# Altium project Elec391_Project_Gen_2.PrjPcb
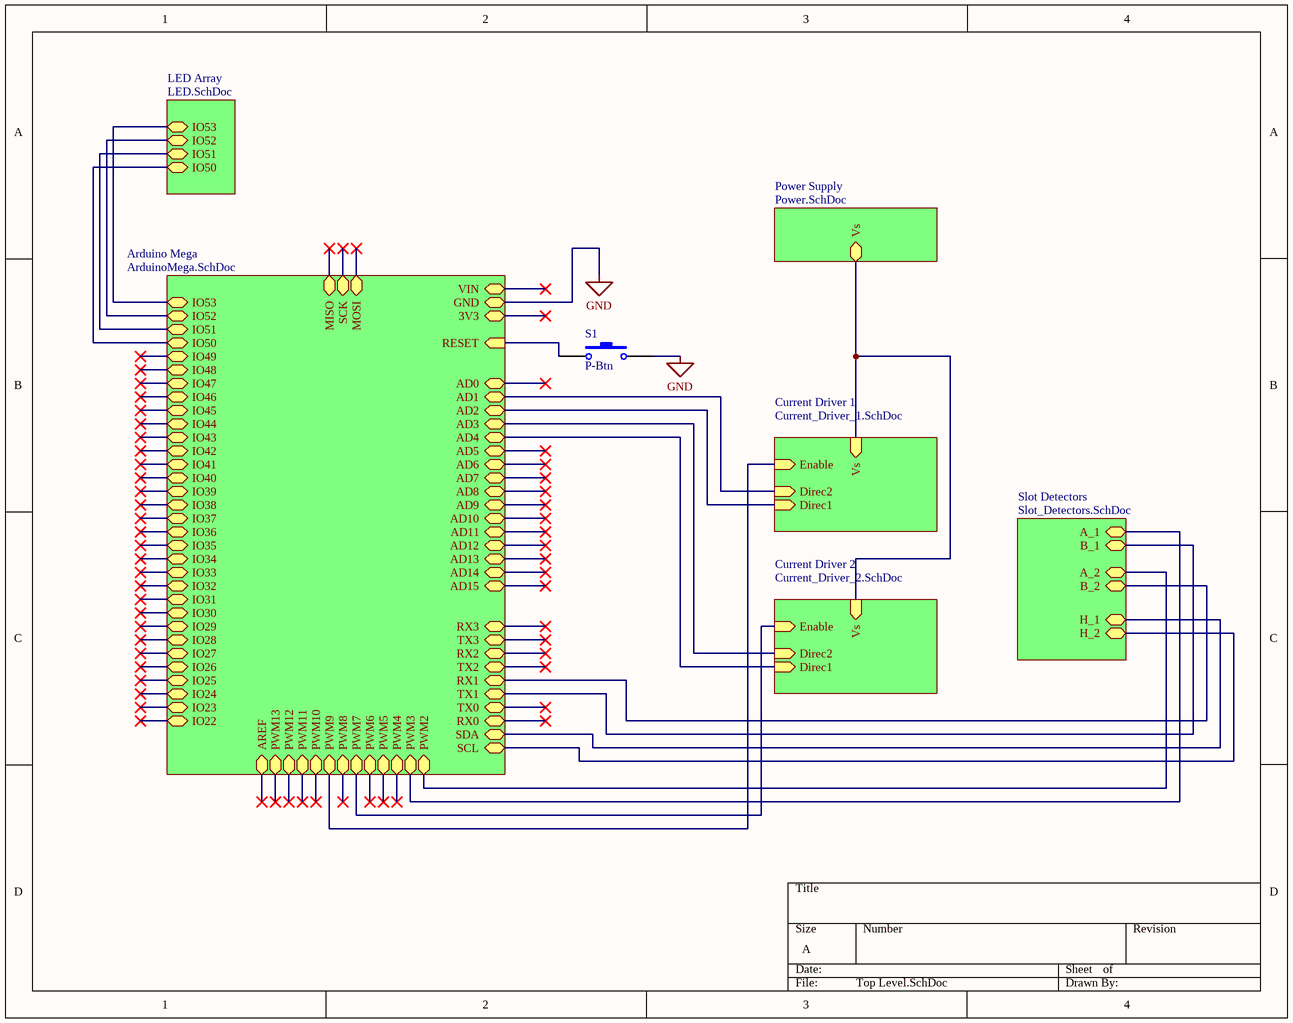
[diagram p0: Top Level.SchDoc]
7 sheets, 40 parts. Net scope: hierarchical (ports join the sheet entries above them; power ports are global).
Board file: MainPCB.PcbDoc
Sheets:
  Top Level.SchDoc
    Current Driver 1 = Current_Driver_1.SchDoc
    Current Driver 2 = Current_Driver_2.SchDoc
    Arduino Mega = ArduinoMega.SchDoc
    Slot Detectors = Slot_Detectors.SchDoc
    Power Supply = Power.SchDoc
    LED Array = LED.SchDoc

## Sheet Top Level.SchDoc
size A

### Parts
S1  P-Btn  [SPST-2_LGE1.0]

### Sub-sheets
Arduino Mega = ArduinoMega.SchDoc: AD9 (bidir), AD8 (bidir), AD12 (bidir), AD10 (bidir), AD14 (bidir), AD15 (bidir), AD13 (bidir), AD11 (bidir), AD0 (bidir), AD1 (bidir), AD2 (bidir), AD6 (bidir), AD3 (bidir), AD7 (bidir), AD4 (bidir), AD5 (bidir), GND, 3V3, VIN, RESET (in), RX3 (bidir), SDA (bidir), TX2 (bidir), TX0 (bidir), RX0 (bidir), TX1 (bidir), TX3 (bidir), RX1 (bidir), RX2 (bidir), SCL (bidir), MISO (bidir), SCK (bidir), MOSI (bidir), IO52 (bidir), IO50 (bidir), IO51 (bidir), IO53 (bidir), IO46 (bidir), IO44 (bidir), IO45 (bidir), IO43 (bidir), IO41 (bidir), IO47 (bidir), IO49 (bidir), IO42 (bidir), IO40 (bidir), IO48 (bidir), IO33 (bidir), IO34 (bidir), IO32 (bidir), IO29 (bidir), IO39 (bidir), IO31 (bidir), IO28 (bidir), IO27 (bidir), IO25 (bidir), IO23 (bidir), IO30 (bidir), IO26 (bidir), IO22 (bidir), IO24 (bidir), IO38 (bidir), IO35 (bidir), IO37 (bidir), IO36 (bidir), PWM2 (bidir), PWM11 (bidir), PWM8 (bidir), PWM12 (bidir), PWM10 (bidir), PWM13 (bidir), PWM7 (bidir), PWM4 (bidir), PWM5 (bidir), PWM6 (bidir), PWM3 (bidir), AREF (bidir), PWM9 (bidir)
Current Driver 1 = Current_Driver_1.SchDoc: Enable (in), Direc2 (in), Direc1 (in), Vs (in)
Current Driver 2 = Current_Driver_2.SchDoc: Direc1 (in), Enable (in), Direc2 (in), Vs (in)
LED Array = LED.SchDoc: IO53 (bidir), IO52 (bidir), IO51 (bidir), IO50 (bidir)
Power Supply = Power.SchDoc: Vs
Slot Detectors = Slot_Detectors.SchDoc: A_1 (bidir), B_1 (bidir), A_2 (bidir), B_2 (bidir), H_1, H_2

### Nets
GND: S1.2 ; sheet Arduino Mega/GND
AD1: sheet Current Driver 1/Direc2, sheet Arduino Mega/AD1
AD2: sheet Current Driver 1/Direc1, sheet Arduino Mega/AD2
AD3: sheet Current Driver 2/Direc2, sheet Arduino Mega/AD3
AD4: sheet Current Driver 2/Direc1, sheet Arduino Mega/AD4
IO50: sheet Arduino Mega/IO50, sheet LED Array/IO50
IO51: sheet Arduino Mega/IO51, sheet LED Array/IO51
IO52: sheet Arduino Mega/IO52, sheet LED Array/IO52
IO53: sheet Arduino Mega/IO53, sheet LED Array/IO53
PWM2: sheet Arduino Mega/PWM2, sheet Slot Detectors/A_2
PWM3: sheet Arduino Mega/PWM3, sheet Slot Detectors/A_1
PWM7: sheet Current Driver 2/Enable, sheet Arduino Mega/PWM7
PWM9: sheet Current Driver 1/Enable, sheet Arduino Mega/PWM9
RESET: S1.1 ; sheet Arduino Mega/RESET
RX1: sheet Arduino Mega/RX1, sheet Slot Detectors/B_2
SCL: sheet Arduino Mega/SCL, sheet Slot Detectors/H_2
SDA: sheet Arduino Mega/SDA, sheet Slot Detectors/H_1
TX1: sheet Arduino Mega/TX1, sheet Slot Detectors/B_1
Vs: sheet Current Driver 1/Vs, sheet Current Driver 2/Vs, sheet Power Supply/Vs

### Library data of the parts
S1 = P-Btn: Push Button; Published: 24-Mar-1999; LatestRevisionDate: 17-Jul-2002; LatestRevisionNote: Re-released for DXP Platform.; PackageReference: SPST-2; Publisher: Altium Limited; ComponentLink1Description: Datasheet (ELEC391); ComponentLink1URL: http://industrial.panasonic.com/cdbs/www-data/pdf/ATK0000/ATK0000CE11.pdf

## Sheet Current_Driver_1.SchDoc
size A
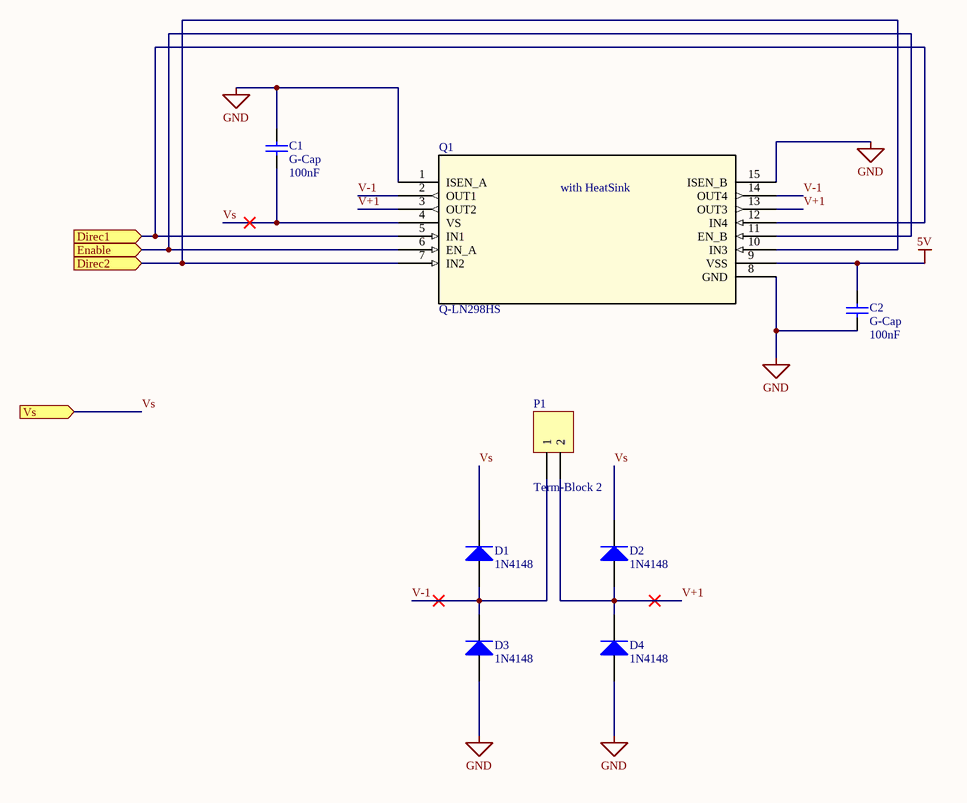
[diagram p1: Current_Driver_1.SchDoc]

### Parts
C1  G-Cap  value 100nF  [Cap2.54mm_LGE1.0]
C2  G-Cap  value 100nF  [Cap2.54mm_LGE1.0]
D1  1N4148  [DO-41_XLGE1.2]
D2  1N4148  [DO-41_XLGE1.2]
D3  1N4148  [DO-41_XLGE1.2]
D4  1N4148  [DO-41_XLGE1.2]
P1  Term-Block 2  [TERM-BLOCK-5.08MM-2POS]
Q1  Q-LN298HS  [Multiwatt15_V_ELEC391HS]

### Ports
Direc1 (in), Direc2 (in), Enable (in), Vs (in)

### Nets
5V: C2.2 Q1.9(VSS)
GND: C1.2 C2.1 D3.1(A) D4.1(A) Q1.1(ISEN_A) Q1.8(GND) Q1.15(ISEN_B)
AD1: Q1.7(IN2) Q1.10(IN3) ; port Direc2
AD2: Q1.5(IN1) Q1.12(IN4) ; port Direc1
PWM9: Q1.6(EN_A) Q1.11(EN_B) ; port Enable
V+1: D2.1(A) D4.2(K) P1.2 Q1.3(OUT2) Q1.13(OUT3)
V-1: D1.1(A) D3.2(K) P1.1 Q1.2(OUT1) Q1.14(OUT4)
Vs: C1.1 D1.2(K) D2.2(K) Q1.4(VS) ; port Vs

### Notes on the sheet
- (in symbol Q-LN298HS) with HeatSink

### Library data of the parts
C1 C2 = G-Cap: Capacitor (specify value); Published: 8-Jun-2000; LatestRevisionDate: 17-Jul-2002; LatestRevisionNote: Re-released for DXP Platform.; PackageReference: RAD-0.3; Publisher: Altium Limited
D1-D4 = T-DiodeRect: High-speed Diode; ComponentLink1URL: http://www.mccsemi.com/up_pdf/1N4148(DO-35).pdf; ComponentLink1Description: Datasheet (ELEC391)
P1 = C-Block2: Terminal-Block 1x2; LatestRevisionDate: 17-Jul-2002; LatestRevisionNote: Re-released for DXP Platform.; Publisher: Altium Limited
Q1 = Q-LN298HS: LN298 - IC Bridge Driver Par 15Multiwatt; Manufacturer_Part_Number: L298N; Vendor: ST Microelectronics; Input Type: Non-Inverting; Number of Outputs: 4; Current - Output / Channel: 2A; Current - Peak Output: 3A; Voltage - Supply: 4.5 V ~ 46 V; C: Copyright (C) 2015 Accelerated Designs. All rights reserved; Quantity_Available: 5651; DataSheet: http://www.st.com/internet/com/TECHNICAL_RESOURCES/TECHNICAL_LITERATURE/DATASHEET/CD00000240.pdf; Type: Type; On-State Resistance: -; Operating Temperature: -25Â°C ~ 130Â°C; Mounting Type: Through Hole; Package / Case: Multiwatt-15 (Vertical, Bent and Staggered Leads); Supplier Device Package: 15-Multiwatt; Packaging: Tube; Copyright: Copyright (C) 2015 Accelerated Designs. All rights reserved; RefDes: RefDes; Value: Value; ComponentLink1URL: http://www.st.com/content/ccc/resource/technical/document/datasheet/82/cc/3f/39/0a/29/4d/f0/CD00000240.pdf/files/CD00000240.pdf/jcr:content/translations/en.CD00000240.pdf; ComponentLink1Description: Datasheet (ELEC391)

## Sheet Current_Driver_2.SchDoc
size A
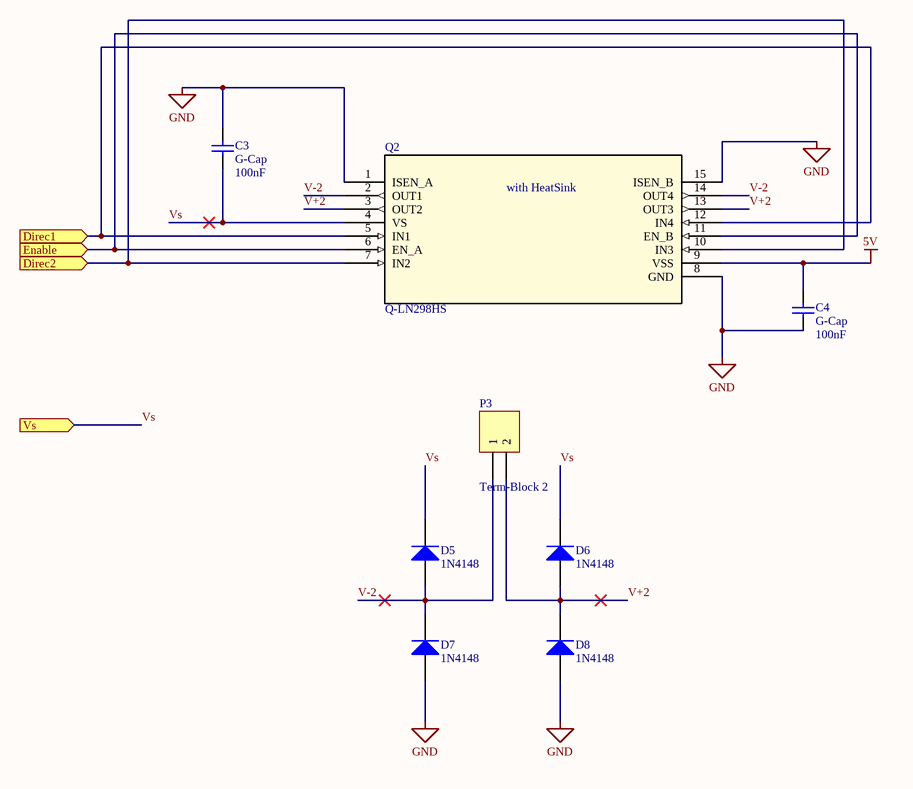
[diagram p2: Current_Driver_2.SchDoc]

### Parts
C3  G-Cap  value 100nF  [Cap2.54mm_LGE1.0]
C4  G-Cap  value 100nF  [Cap2.54mm_LGE1.0]
D5  1N4148  [DO-41_XLGE1.2]
D6  1N4148  [DO-41_XLGE1.2]
D7  1N4148  [DO-41_XLGE1.2]
D8  1N4148  [DO-41_XLGE1.2]
P3  Term-Block 2  [TERM-BLOCK-5.08MM-2POS]
Q2  Q-LN298HS  [Multiwatt15_V_ELEC391HS]

### Ports
Direc1 (in), Direc2 (in), Enable (in), Vs (in)

### Nets
5V: C4.2 Q2.9(VSS)
GND: C3.2 C4.1 D7.1(A) D8.1(A) Q2.1(ISEN_A) Q2.8(GND) Q2.15(ISEN_B)
AD3: Q2.7(IN2) Q2.10(IN3) ; port Direc2
AD4: Q2.5(IN1) Q2.12(IN4) ; port Direc1
PWM7: Q2.6(EN_A) Q2.11(EN_B) ; port Enable
V+2: D6.1(A) D8.2(K) P3.2 Q2.3(OUT2) Q2.13(OUT3)
V-2: D5.1(A) D7.2(K) P3.1 Q2.2(OUT1) Q2.14(OUT4)
Vs: C3.1 D5.2(K) D6.2(K) Q2.4(VS) ; port Vs

### Notes on the sheet
- (in symbol Q-LN298HS) with HeatSink

### Library data of the parts
C3 C4 = G-Cap: Capacitor (specify value); Published: 8-Jun-2000; LatestRevisionDate: 17-Jul-2002; LatestRevisionNote: Re-released for DXP Platform.; PackageReference: RAD-0.3; Publisher: Altium Limited
D5-D8 = T-DiodeRect: High-speed Diode; ComponentLink1URL: http://www.mccsemi.com/up_pdf/1N4148(DO-35).pdf; ComponentLink1Description: Datasheet (ELEC391)
P3 = C-Block2: Terminal-Block 1x2; LatestRevisionDate: 17-Jul-2002; LatestRevisionNote: Re-released for DXP Platform.; Publisher: Altium Limited
Q2 = Q-LN298HS: as Q1 on sheet Current_Driver_1; Quantity_Available: 5651; DataSheet: http://www.st.com/internet/com/TECHNICAL_RESOURCES/TECHNICAL_LITERATURE/DATASHEET/CD00000240.pdf; Type: Type; On-State Resistance: -; Operating Temperature: -25Â°C ~ 130Â°C; Mounting Type: Through Hole; Package / Case: Multiwatt-15 (Vertical, Bent and Staggered Leads); Supplier Device Package: 15-Multiwatt; Packaging: Tube; Copyright: Copyright (C) 2015 Accelerated Designs. All rights reserved; RefDes: RefDes; Value: Value; ComponentLink1URL: http://www.st.com/content/ccc/resource/technical/document/datasheet/82/cc/3f/39/0a/29/4d/f0/CD00000240.pdf/files/CD00000240.pdf/jcr:content/translations/en.CD00000240.pdf; ComponentLink1Description: Datasheet (ELEC391)

## Sheet ArduinoMega.SchDoc
size A
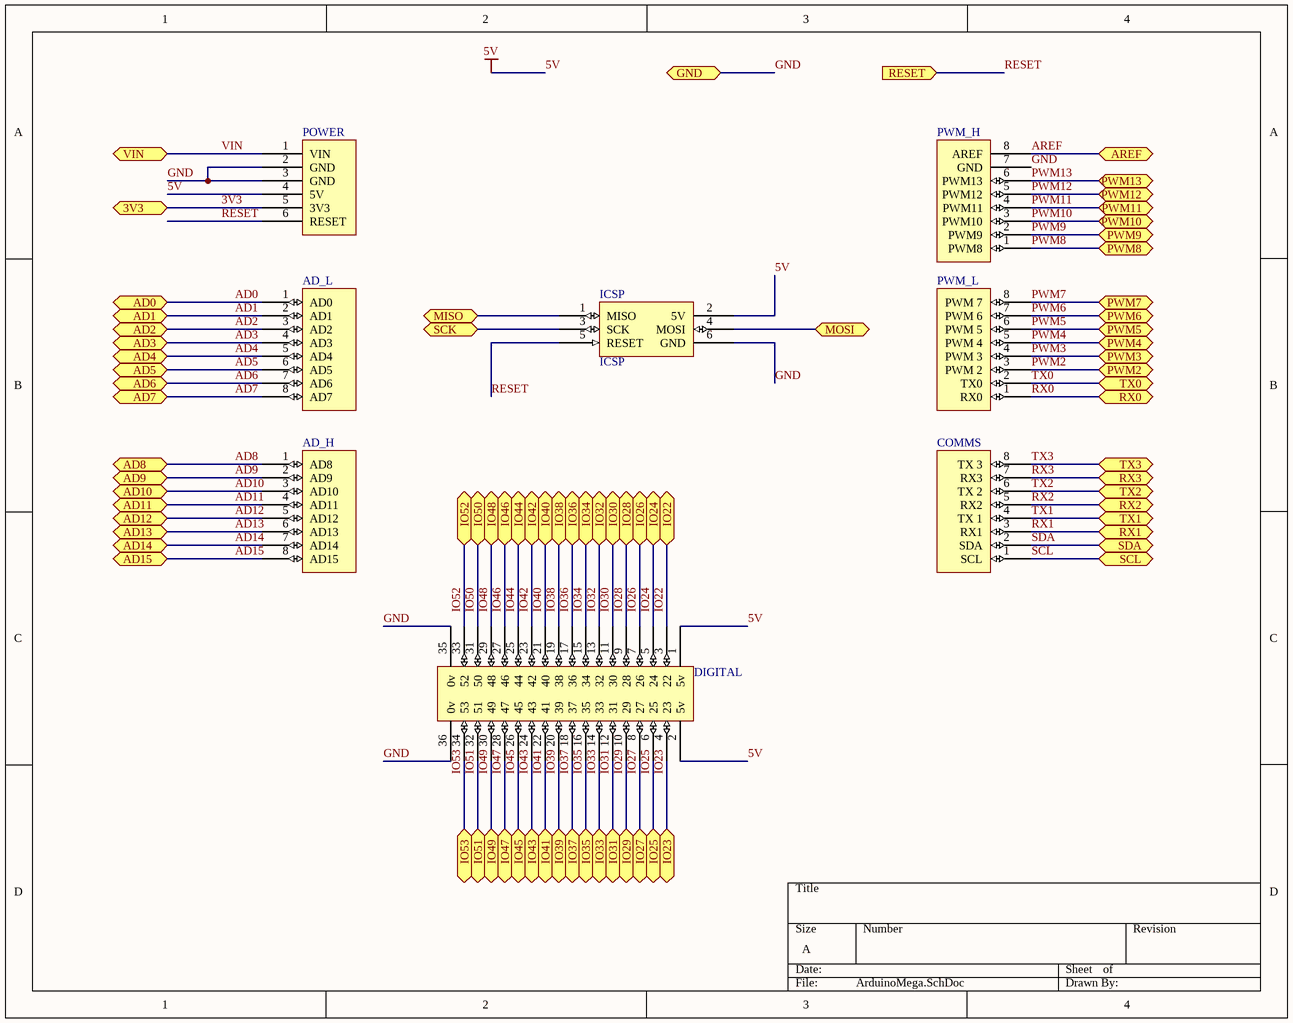
[diagram p3: ArduinoMega.SchDoc]

### Parts
AD_H  AD_H  [HDR1X8]  (value not drawn)
AD_L  AD_L  [HDR1X8]  (value not drawn)
COMMS  Communication  [HDR1X8]  (value not drawn)
DIGITAL  IO_36  [HDR2X18]  (value not drawn)
ICSP  ICSP  [ICSP]
POWER  POWER  [HDR1X6]  (value not drawn)
PWM_H  PWM_H  [HDR1X8]  (value not drawn)
PWM_L  PWM_L  [HDR1X8]  (value not drawn)

### Ports
3V3, AD0 (bidir), AD1 (bidir), AD2 (bidir), AD3 (bidir), AD4 (bidir), AD5 (bidir), AD6 (bidir), AD7 (bidir), AD8 (bidir), AD9 (bidir), AD10 (bidir), AD11 (bidir), AD12 (bidir), AD13 (bidir), AD14 (bidir), AD15 (bidir), AREF (bidir), GND, IO22 (bidir), IO23 (bidir), IO24 (bidir), IO25 (bidir), IO26 (bidir), IO27 (bidir), IO28 (bidir), IO29 (bidir), IO30 (bidir), IO31 (bidir), IO32 (bidir), IO33 (bidir), IO34 (bidir), IO35 (bidir), IO36 (bidir), IO37 (bidir), IO38 (bidir), IO39 (bidir), IO40 (bidir), IO41 (bidir), IO42 (bidir), IO43 (bidir), IO44 (bidir), IO45 (bidir), IO46 (bidir), IO47 (bidir), IO48 (bidir), IO49 (bidir), IO50 (bidir), IO51 (bidir), IO52 (bidir), IO53 (bidir), MISO (bidir), MOSI (bidir), PWM2 (bidir), PWM3 (bidir), PWM4 (bidir), PWM5 (bidir), PWM6 (bidir), PWM7 (bidir), PWM8 (bidir), PWM9 (bidir), PWM10 (bidir), PWM11 (bidir), PWM12 (bidir), PWM13 (bidir), RESET (in), RX0 (bidir), RX1 (bidir), RX2 (bidir), RX3 (bidir), SCK (bidir), SCL (bidir), SDA (bidir), TX0 (bidir), TX1 (bidir), TX2 (bidir), TX3 (bidir), VIN

### Nets
5V: DIGITAL.1(5v) DIGITAL.2(5v) ICSP.2(5V) POWER.4(5V)
GND: DIGITAL.35(0v) DIGITAL.36(0v) ICSP.6(GND) POWER.2(GND) POWER.3(GND) PWM_H.7(GND) ; port GND
3V3: POWER.5(3V3) ; port 3V3
AD0: AD_L.1(AD0) ; port AD0
AD1: AD_L.2(AD1) ; port AD1
AD2: AD_L.3(AD2) ; port AD2
AD3: AD_L.4(AD3) ; port AD3
AD4: AD_L.5(AD4) ; port AD4
AD5: AD_L.6(AD5) ; port AD5
AD6: AD_L.7(AD6) ; port AD6
AD7: AD_L.8(AD7) ; port AD7
AD8: AD_H.1(AD8) ; port AD8
AD9: AD_H.2(AD9) ; port AD9
AD10: AD_H.3(AD10) ; port AD10
AD11: AD_H.4(AD11) ; port AD11
AD12: AD_H.5(AD12) ; port AD12
AD13: AD_H.6(AD13) ; port AD13
AD14: AD_H.7(AD14) ; port AD14
AD15: AD_H.8(AD15) ; port AD15
AREF: PWM_H.8(AREF) ; port AREF
IO22: DIGITAL.3(22) ; port IO22
IO23: DIGITAL.4(23) ; port IO23
IO24: DIGITAL.5(24) ; port IO24
IO25: DIGITAL.6(25) ; port IO25
IO26: DIGITAL.7(26) ; port IO26
IO27: DIGITAL.8(27) ; port IO27
IO28: DIGITAL.9(28) ; port IO28
IO29: DIGITAL.10(29) ; port IO29
IO30: DIGITAL.11(30) ; port IO30
IO31: DIGITAL.12(31) ; port IO31
IO32: DIGITAL.13(32) ; port IO32
IO33: DIGITAL.14(33) ; port IO33
IO34: DIGITAL.15(34) ; port IO34
IO35: DIGITAL.16(35) ; port IO35
IO36: DIGITAL.17(36) ; port IO36
IO37: DIGITAL.18(37) ; port IO37
IO38: DIGITAL.19(38) ; port IO38
IO39: DIGITAL.20(39) ; port IO39
IO40: DIGITAL.21(40) ; port IO40
IO41: DIGITAL.22(41) ; port IO41
IO42: DIGITAL.23(42) ; port IO42
IO43: DIGITAL.24(43) ; port IO43
IO44: DIGITAL.25(44) ; port IO44
IO45: DIGITAL.26(45) ; port IO45
IO46: DIGITAL.27(46) ; port IO46
IO47: DIGITAL.28(47) ; port IO47
IO48: DIGITAL.29(48) ; port IO48
IO49: DIGITAL.30(49) ; port IO49
IO50: DIGITAL.31(50) ; port IO50
IO51: DIGITAL.32(51) ; port IO51
IO52: DIGITAL.33(52) ; port IO52
IO53: DIGITAL.34(53) ; port IO53
PWM2: PWM_L.3(PWM_2) ; port PWM2
PWM3: PWM_L.4(PWM_3) ; port PWM3
PWM4: PWM_L.5(PWM_4) ; port PWM4
PWM5: PWM_L.6(PWM_5) ; port PWM5
PWM6: PWM_L.7(PWM_6) ; port PWM6
PWM7: PWM_L.8(PWM_7) ; port PWM7
PWM8: PWM_H.1(PWM8) ; port PWM8
PWM9: PWM_H.2(PWM9) ; port PWM9
PWM10: PWM_H.3(PWM10) ; port PWM10
PWM11: PWM_H.4(PWM11) ; port PWM11
PWM12: PWM_H.5(PWM12) ; port PWM12
PWM13: PWM_H.6(PWM13) ; port PWM13
RESET: ICSP.5(RESET) POWER.6(RESET) ; port RESET
RX0: PWM_L.1(RX0) ; port RX0
RX1: COMMS.3(RX1) ; port RX1
RX2: COMMS.5(RX2) ; port RX2
RX3: COMMS.7(RX3) ; port RX3
SCL: COMMS.1(SCL) ; port SCL
SDA: COMMS.2(SDA) ; port SDA
TX0: PWM_L.2(TX0) ; port TX0
TX1: COMMS.4(TX_1) ; port TX1
TX2: COMMS.6(TX_2) ; port TX2
TX3: COMMS.8(TX_3) ; port TX3
VIN: POWER.1(VIN) ; port VIN
NetICSP_1: ICSP.1(MISO) ; port MISO
NetICSP_3: ICSP.3(SCK) ; port SCK
NetICSP_4: ICSP.4(MOSI) ; port MOSI

## Sheet Slot_Detectors.SchDoc
size A
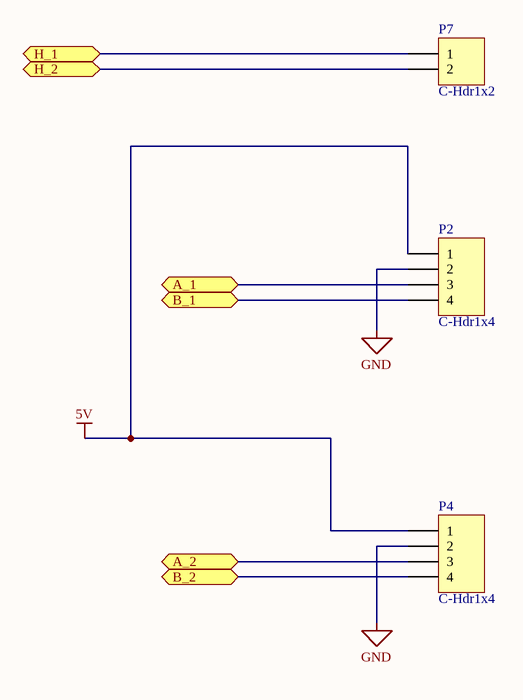
[diagram p4: Slot_Detectors.SchDoc]

### Parts
P2  C-Hdr1x4  [HDR1X4_LGE1.0]
P4  C-Hdr1x4  [HDR1X4_LGE1.0]
P7  C-Hdr1x2  [HDR1X2_LGE1.0]

### Ports
A_1 (bidir), A_2 (bidir), B_1 (bidir), B_2 (bidir), H_1 (bidir), H_2 (bidir)

### Nets
5V: P2.1 P4.1
GND: P2.2 P4.2
PWM2: P4.3 ; port A_2
PWM3: P2.3 ; port A_1
RX1: P4.4 ; port B_2
SCL: P7.2 ; port H_2
SDA: P7.1 ; port H_1
TX1: P2.4 ; port B_1

### Library data of the parts
P2 P4 = C-Hdr1x4: Header, 4-Pin; LatestRevisionDate: 17-Jul-2002; LatestRevisionNote: Re-released for DXP Platform.; Publisher: Altium Limited
P7 = C-Hdr1x2: Header, 2-Pin; LatestRevisionDate: 17-Jul-2002; LatestRevisionNote: Re-released for DXP Platform.; Publisher: Altium Limited

## Sheet Power.SchDoc
size A
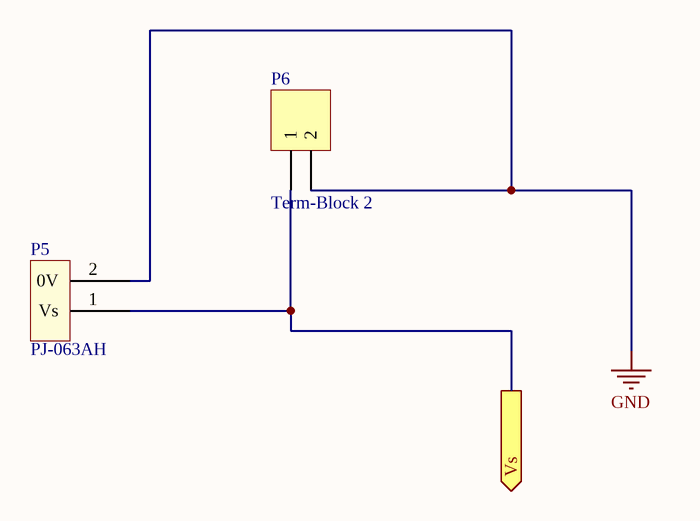
[diagram p5: Power.SchDoc]

### Parts
P5  PJ-063AH  [PJ-063AH]
P6  Term-Block 2  [TERM-BLOCK-5.08MM-2POS]

### Ports
Vs (out)

### Nets
GND: P5.2(0V) P6.2
Vs: P5.1(Vs) P6.1 ; port Vs

### Library data of the parts
P6 = C-Block2: Terminal-Block 1x2; LatestRevisionDate: 17-Jul-2002; LatestRevisionNote: Re-released for DXP Platform.; Publisher: Altium Limited

## Sheet LED.SchDoc
size A
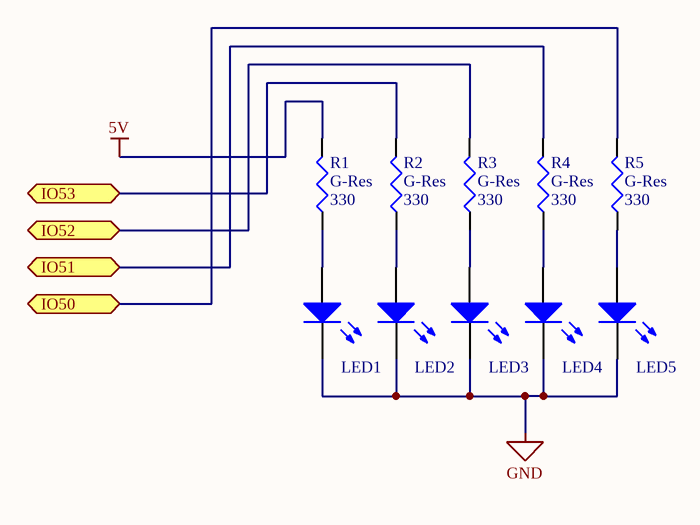
[diagram p6: LED.SchDoc]

### Parts
LED1  C503B-RAN-CY0B0AA1  [LED_LGE1.0]  (value not drawn)
LED2  C503B-RAN-CY0B0AA1  [LED_LGE1.0]  (value not drawn)
LED3  C503B-RAN-CY0B0AA1  [LED_LGE1.0]  (value not drawn)
LED4  C503B-RAN-CY0B0AA1  [LED_LGE1.0]  (value not drawn)
LED5  C503B-RAN-CY0B0AA1  [LED_LGE1.0]  (value not drawn)
R1  G-Res  value 330  [Res10mm_LGE1.0]
R2  G-Res  value 330  [Res10mm_LGE1.0]
R3  G-Res  value 330  [Res10mm_LGE1.0]
R4  G-Res  value 330  [Res10mm_LGE1.0]
R5  G-Res  value 330  [Res10mm_LGE1.0]

### Ports
IO50 (bidir), IO51 (bidir), IO52 (bidir), IO53 (bidir)

### Nets
5V: R1.2
GND: LED1.2(K) LED2.2(K) LED3.2(K) LED4.2(K) LED5.2(K)
IO50: R5.2 ; port IO50
IO51: R4.2 ; port IO51
IO52: R3.2 ; port IO52
IO53: R2.2 ; port IO53
NetLED1_1: LED1.1(A) R1.1
NetLED2_1: LED2.1(A) R2.1
NetLED3_1: LED3.1(A) R3.1
NetLED4_1: LED4.1(A) R4.1
NetLED5_1: LED5.1(A) R5.1

### Library data of the parts
LED1-LED5 = T-LEDRedHI: LED (high intensity - red); ComponentLink1URL: http://www.cree.com/~/media/Files/Cree/LED%20Components%20and%20Modules/HB/Data%20Sheets/C503B%20RAS%20RAN%20AAS%20AAN%20RBS%20RBN%20ABS%20ABN%20RCS%20RCN%20ACS%20ACN%201079.pdf; ComponentLink1Description: Datasheet (ELEC391)
R1-R5 = G-Res: Resistor (specify value); Published: 8-Jun-2000; LatestRevisionDate: 29-May-2009; LatestRevisionNote: IPC-7351 Footprint Added.; PackageReference: J1-0603; Publisher: Altium Limited; PackageDescription: Chip Resistor

## Nets that join several sheets
5V: Current_Driver_1 (C2.2 Q1.9), Current_Driver_2 (C4.2 Q2.9), ArduinoMega (DIGITAL.1 DIGITAL.2 ICSP.2 POWER.4), Slot_Detectors (P2.1 P4.1), LED (R1.2)
GND: Top Level (S1.2), Current_Driver_1 (7 pins), Current_Driver_2 (7 pins), ArduinoMega (6 pins), Slot_Detectors (P2.2 P4.2), Power (P5.2 P6.2), LED (5 pins)
AD1: Current_Driver_1 (Q1.7 Q1.10), ArduinoMega (AD_L.2)
AD2: Current_Driver_1 (Q1.5 Q1.12), ArduinoMega (AD_L.3)
AD3: Current_Driver_2 (Q2.7 Q2.10), ArduinoMega (AD_L.4)
AD4: Current_Driver_2 (Q2.5 Q2.12), ArduinoMega (AD_L.5)
IO50: ArduinoMega (DIGITAL.31), LED (R5.2)
IO51: ArduinoMega (DIGITAL.32), LED (R4.2)
IO52: ArduinoMega (DIGITAL.33), LED (R3.2)
IO53: ArduinoMega (DIGITAL.34), LED (R2.2)
PWM2: ArduinoMega (PWM_L.3), Slot_Detectors (P4.3)
PWM3: ArduinoMega (PWM_L.4), Slot_Detectors (P2.3)
PWM7: Current_Driver_2 (Q2.6 Q2.11), ArduinoMega (PWM_L.8)
PWM9: Current_Driver_1 (Q1.6 Q1.11), ArduinoMega (PWM_H.2)
RESET: Top Level (S1.1), ArduinoMega (ICSP.5 POWER.6)
RX1: ArduinoMega (COMMS.3), Slot_Detectors (P4.4)
SCL: ArduinoMega (COMMS.1), Slot_Detectors (P7.2)
SDA: ArduinoMega (COMMS.2), Slot_Detectors (P7.1)
TX1: ArduinoMega (COMMS.4), Slot_Detectors (P2.4)
Vs: Current_Driver_1 (C1.1 D1.2 D2.2 Q1.4), Current_Driver_2 (C3.1 D5.2 D6.2 Q2.4), Power (P5.1 P6.1)